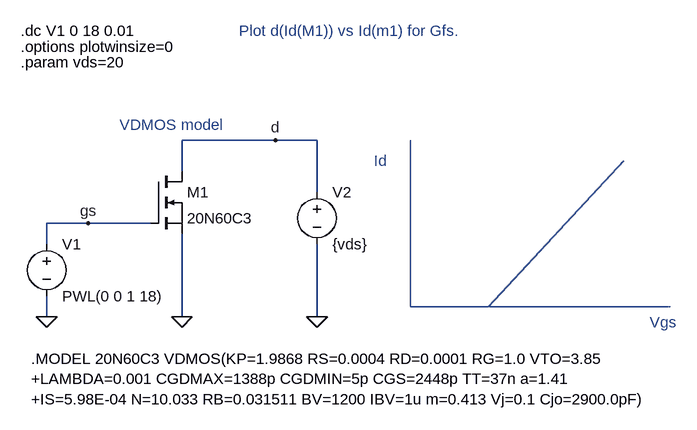
[diagram p0: schematic 20N60C3_Id(Vgs).asc]
20N60C3_Id(Vgs).asc, the LTspice schematic file:
Version 4
SHEET 1 2828 1468
WIRE 256 400 112 400
WIRE 320 400 256 400
WIRE 112 448 112 400
WIRE 320 480 320 400
WIRE -32 528 -96 528
WIRE 64 528 -32 528
WIRE -96 560 -96 528
WIRE -96 672 -96 640
WIRE 112 672 112 544
WIRE 320 672 320 560
FLAG -96 672 0
FLAG 112 672 0
FLAG -32 528 gs
FLAG 256 400 d
FLAG 320 672 0
SYMBOL voltage -96 544 R0
WINDOW 123 0 0 Left 0
WINDOW 39 0 0 Left 0
SYMATTR InstName V1
SYMATTR Value PWL(0 0 1 18)
SYMBOL voltage 320 464 R0
WINDOW 123 0 0 Left 0
WINDOW 39 0 0 Left 0
SYMATTR InstName V2
SYMATTR Value {vds}
TEXT -136 232 Left 0 !.dc V1 0 18 0.01
TEXT 408 432 Left 0 ;Id
TEXT 832 680 Left 0 ;Vgs
TEXT -136 256 Left 0 !.options plotwinsize=0
TEXT 16 376 Left 0 ;VDMOS model
TEXT 200 232 Left 0 ;Plot d(Id(M1)) vs Id(m1) for Gfs.
LINE Normal 464 656 464 400
LINE Normal 864 656 464 656
LINE Normal 584 656 472 656
LINE Normal 792 432 584 656
SYMBOL NMOS 64 448 R0
SYMATTR InstName M1
SYMATTR Value 20N60C3
TEXT -136 280 Left 0 !.param vds=20
TEXT -120 736 Left 0 !.MODEL 20N60C3 VDMOS(KP=1.9868 RS=0.0004 RD=0.0001 RG=1.0 VTO=3.85 \n+LAMBDA=0.001 CGDMAX=1388p CGDMIN=5p CGS=2448p TT=37n a=1.41\n+IS=5.98E-04 N=10.033 RB=0.031511 BV=1200 IBV=1u m=0.413 Vj=0.1 Cjo=2900.0pF)

The netlist it stands for:
* 20N60C3_Id(Vgs).asc
V1 gs 0 PWL(0 0 1 18)
V2 d 0 {vds}
M1 d gs 0 0 20N60C3
.model NMOS NMOS
.model PMOS PMOS
.lib standard.mos
.dc V1 0 18 0.01
* Id
* Vgs
.options plotwinsize=0
* VDMOS model
* Plot d(Id(M1)) vs Id(m1) for Gfs.
.param vds=20
.MODEL 20N60C3 VDMOS(KP=1.9868 RS=0.0004 RD=0.0001 RG=1.0 VTO=3.85
+LAMBDA=0.001 CGDMAX=1388p CGDMIN=5p CGS=2448p TT=37n a=1.41
+IS=5.98E-04 N=10.033 RB=0.031511 BV=1200 IBV=1u m=0.413 Vj=0.1 Cjo=2900.0pF)
.backanno
.end